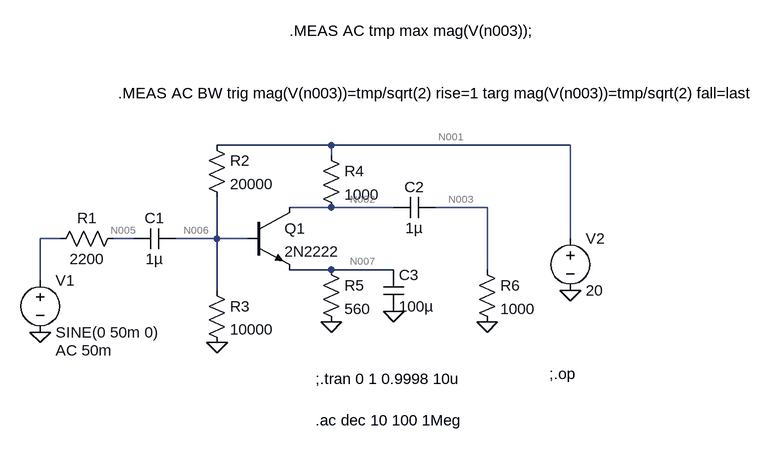
[diagram p0: schematic Prelab 3.asc]
Prelab 3.asc, the LTspice schematic file:
Version 4
SHEET 1 1088 680
WIRE 272 -32 96 -32
WIRE 640 -32 272 -32
WIRE 272 -16 272 -32
WIRE 272 64 208 64
WIRE 368 64 272 64
WIRE 512 64 432 64
WIRE -144 112 -176 112
WIRE -32 112 -64 112
WIRE 96 112 96 48
WIRE 96 112 32 112
WIRE 144 112 96 112
WIRE 640 112 640 -32
WIRE 272 160 208 160
WIRE 368 160 272 160
WIRE 512 160 512 64
WIRE -176 176 -176 112
WIRE 96 192 96 112
FLAG -176 256 0
FLAG 96 272 0
FLAG 272 240 0
FLAG 368 224 0
FLAG 512 240 0
FLAG 640 192 0
SYMBOL res -48 96 R90
WINDOW 0 0 56 VBottom 2
WINDOW 3 32 56 VTop 2
SYMATTR InstName R1
SYMATTR Value 2200
SYMBOL res 80 -48 R0
SYMATTR InstName R2
SYMATTR Value 20000
SYMBOL res 80 176 R0
SYMATTR InstName R3
SYMATTR Value 10000
SYMBOL res 256 -32 R0
SYMATTR InstName R4
SYMATTR Value 1000
SYMBOL res 256 144 R0
SYMATTR InstName R5
SYMATTR Value 560
SYMBOL res 496 144 R0
SYMATTR InstName R6
SYMATTR Value 1000
SYMBOL voltage -176 160 R0
WINDOW 123 24 124 Left 2
WINDOW 39 0 0 Left 0
SYMATTR Value2 AC 50m
SYMATTR InstName V1
SYMATTR Value SINE(0 50m 0)
SYMBOL voltage 640 96 R0
WINDOW 123 0 0 Left 0
WINDOW 39 0 0 Left 0
SYMATTR InstName V2
SYMATTR Value 20
SYMBOL npn 144 64 R0
SYMATTR InstName Q1
SYMATTR Value 2N2222
SYMBOL cap 32 96 R90
WINDOW 0 0 32 VBottom 2
WINDOW 3 32 32 VTop 2
SYMATTR InstName C1
SYMATTR Value 1µ
SYMBOL cap 368 80 R270
WINDOW 0 32 32 VTop 2
WINDOW 3 0 32 VBottom 2
SYMATTR InstName C2
SYMATTR Value 1µ
SYMBOL cap 352 160 R0
SYMATTR InstName C3
SYMATTR Value 100µ
TEXT 248 328 Left 2 !;.tran 0 1 0.9998 10u
TEXT 248 392 Left 2 !.ac dec 10 100 1Meg
TEXT 608 320 Left 2 !;.op
TEXT 208 -208 Left 2 !.MEAS AC tmp max mag(V(n003));
TEXT -56 -112 Left 2 !.MEAS AC BW trig mag(V(n003))=tmp/sqrt(2) rise=1 targ mag(V(n003))=tmp/sqrt(2) fall=last

The netlist it stands for:
* Prelab 3.asc
R1 N005 N004 2200
R2 N001 N006 20000
R3 N006 0 10000
R4 N001 N002 1000
R5 N007 0 560
R6 N003 0 1000
V1 N004 0 SINE(0 50m 0) AC 50m
V2 N001 0 20
Q1 N002 N006 N007 0 2N2222
C1 N006 N005 1µ
C2 N002 N003 1µ
C3 N007 0 100µ
.model NPN NPN
.model PNP PNP
.lib standard.bjt
;.tran 0 1 0.9998 10u
.ac dec 10 100 1Meg
;.op
.MEAS AC tmp max mag(V(n003));
.MEAS AC BW trig mag(V(n003))=tmp/sqrt(2) rise=1 targ mag(V(n003))=tmp/sqrt(2) fall=last
.backanno
.end

* Results of the author's LTspice run, read from the files saved beside the schematic
* Operating Point, zero values left out:
*   V(n001) = 20 V
*   V(n006) = 6.335 V
*   V(n002) = 10.02 V
*   V(n007) = 5.618 V
*   Ic(Q1) = 9.983 mA
*   Ib(Q1) = 49.69 µA
*   Ie(Q1) = -10.03 mA
*   I(R5) = 10.03 mA
*   I(R4) = 9.983 mA
*   I(R3) = 633.5 µA
*   I(R2) = 683.2 µA
*   I(V2) = -10.67 mA
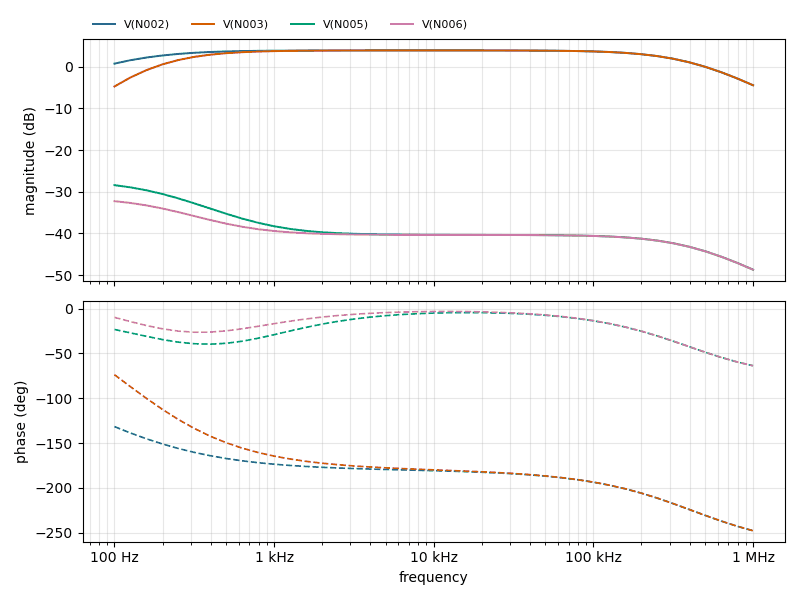
[diagram p1: AC Analysis of Prelab 3.asc, plotted from the saved traces]
* AC Analysis, 1 run:
*   V(N002): 0.76 dB at 100 Hz, -4.43 dB at 1 MHz, peak 3.93 dB at 7.943 kHz, 3 dB below the peak at 104.7 Hz and 412 kHz
*   V(N003): -4.73 dB at 100 Hz, -4.43 dB at 1 MHz, peak 3.93 dB at 10 kHz, 3 dB below the peak at 215.2 Hz and 412.1 kHz
*   V(N005): -28.40 dB at 100 Hz, -48.68 dB at 1 MHz, peak -28.40 dB at 100 Hz, 3 dB below the peak at 242.2 Hz
*   V(N006): -32.25 dB at 100 Hz, -48.69 dB at 1 MHz, peak -32.25 dB at 100 Hz, 3 dB below the peak at 276 Hz
* From the log:
*   tmp: MAX(mag(v(n003)))=(3.9266dB,0°) FROM 100 TO 1e+006
*   bw=414205 FROM 215.786 TO 414421